# Altium schematic sheet LPCB235 - GIMBAL BUFFER.SchDoc
size A3; Address1: Factory 10; Address2: 9-13 Dingley Avenue, Dandeong, VICTORIA 3175, AUSTRALIA; Revision: 1; SheetNumber: 1; SheetTotal: ?; Lockie__PCB_SUB_ASSEMBLY: PCB Sub Component; Lockie__PCB_ASSEMBLY: PCB Assembly; Lockie__LDL: LPCBxxx; Lockie__PCB_DESCRIPTION: PCB Description
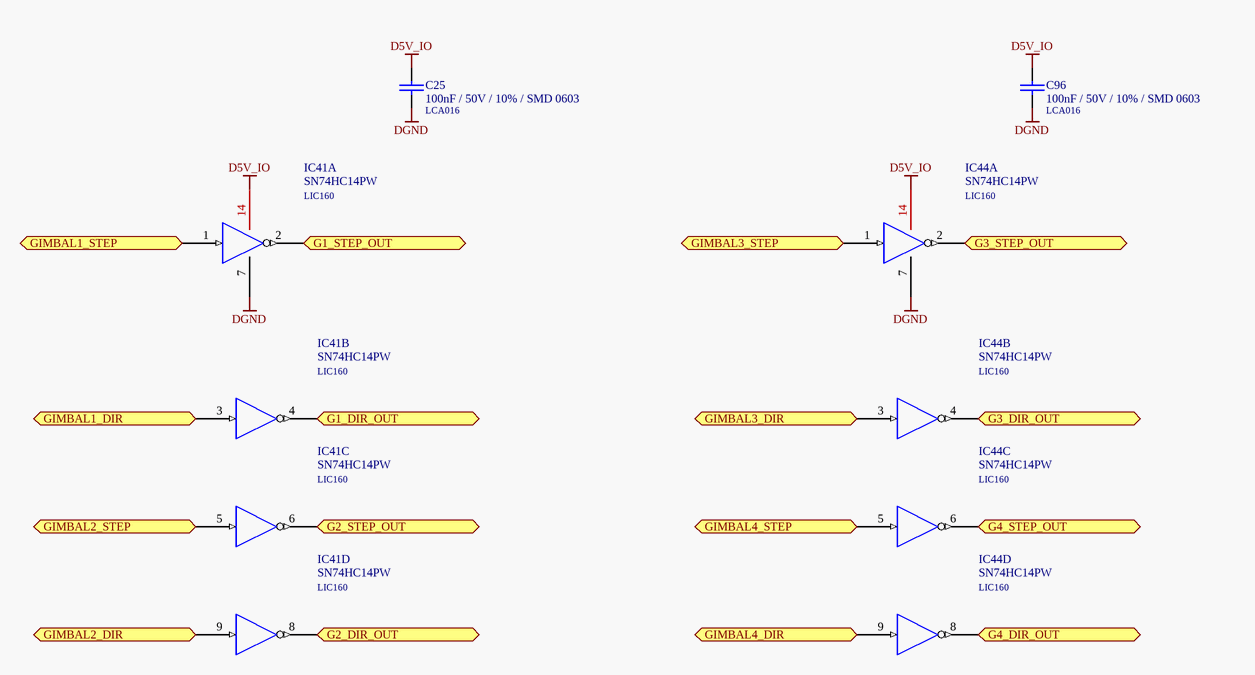
[diagram p0: LPCB235 - GIMBAL BUFFER.SchDoc]

## Parts
C25  100nF / 50V / 10% / SMD 0603  LDL_NUMBER: LCA016  [LFP011__CC1608-0603-IPC7351_B]
C96  100nF / 50V / 10% / SMD 0603  LDL_NUMBER: LCA016  [LFP011__CC1608-0603-IPC7351_B]
IC41  SN74HC14PW  LDL_NUMBER: LIC160  [PW014]  (parts A,B,C,D of 6)
IC44  SN74HC14PW  LDL_NUMBER: LIC160  [PW014]  (parts A,B,C,D of 6)

## Ports
G1_DIR_OUT (out), G1_STEP_OUT (out), G2_DIR_OUT (out), G2_STEP_OUT (out), G3_DIR_OUT (out), G3_STEP_OUT (out), G4_DIR_OUT (out), G4_STEP_OUT (out), GIMBAL1_DIR (in), GIMBAL1_STEP (in), GIMBAL2_DIR (in), GIMBAL2_STEP (in), GIMBAL3_DIR (in), GIMBAL3_STEP (in), GIMBAL4_DIR (in), GIMBAL4_STEP (in)

## Nets
D5V_IO: C25.1 C96.1 IC41.14(VCC) IC44.14(VCC)
DGND: C25.2 C96.2 IC41.7(GND) IC44.7(GND)
G1_DIR_OUT: IC41.4(Y) ; port G1_DIR_OUT
G1_STEP_OUT: IC41.2(Y) ; port G1_STEP_OUT
G2_DIR_OUT: IC41.8(Y) ; port G2_DIR_OUT
G2_STEP_OUT: IC41.6(Y) ; port G2_STEP_OUT
G3_DIR_OUT: IC44.4(Y) ; port G3_DIR_OUT
G3_STEP_OUT: IC44.2(Y) ; port G3_STEP_OUT
G4_DIR_OUT: IC44.8(Y) ; port G4_DIR_OUT
G4_STEP_OUT: IC44.6(Y) ; port G4_STEP_OUT
GIMBAL1_DIR: IC41.3(A) ; port GIMBAL1_DIR
GIMBAL1_STEP: IC41.1(A) ; port GIMBAL1_STEP
GIMBAL2_DIR: IC41.9(A) ; port GIMBAL2_DIR
GIMBAL2_STEP: IC41.5(A) ; port GIMBAL2_STEP
GIMBAL3_DIR: IC44.3(A) ; port GIMBAL3_DIR
GIMBAL3_STEP: IC44.1(A) ; port GIMBAL3_STEP
GIMBAL4_DIR: IC44.9(A) ; port GIMBAL4_DIR
GIMBAL4_STEP: IC44.5(A) ; port GIMBAL4_STEP

## Notes on the sheet
- PCB COMPONENT DESCRIPTION
- LDL NUMBER
- Assembly Details
- Size
- Drawing File Name
- Revision
- http://sil3.com.au
  ACN: 123 529 064
  Factory 10
  9-13 Dingley Avenue
  Dandenong, VICTORIA
  Australia
- Scale
- A3
- Sheet Details
- N.T.S
- Sheet:
- Of:

## Library data of the parts
C25 C96 = 100nF / 50V / 10% / SMD 0603: Capacitor, Ceramic Chip, 100nF (0.1uF), 50V, 5%, SMD 0603 [LCA016]; Value: 100n; FMEDA__OPERATING__VOLTAGE_MIN: 0; FMEDA__OPERATING__VOLTAGE_MAX: 3.3; FMEDA__OPERATING__TEMP_MIN: -20; FMEDA__OPERATING__TEMP_TYP: 27; FMEDA__OPERATING__TEMP_MAX: 50; FMEDA__CHANNEL: COM; FMEDA__FUNCTION_IN_SYSTEM: *; FMEDA__OPERATING__VOLTAGE_TYP: 3.3
IC41 IC44 = SN74HC14PW: IC, Hex Inveter, Schmitt Trigger, SMD [LIC160]; FMEDA__OPERATING__TEMP_MAX: 50; FMEDA__OPERATING__TEMP_MIN: -20; FMEDA__OPERATING__TEMP_TYP: 27; FMEDA__CHANNEL: COM; Revision: 17-Jul-2002: Re-released for DXP Platform.